# EAGLE design MysensorsSensor (EAGLE 6.6.0)
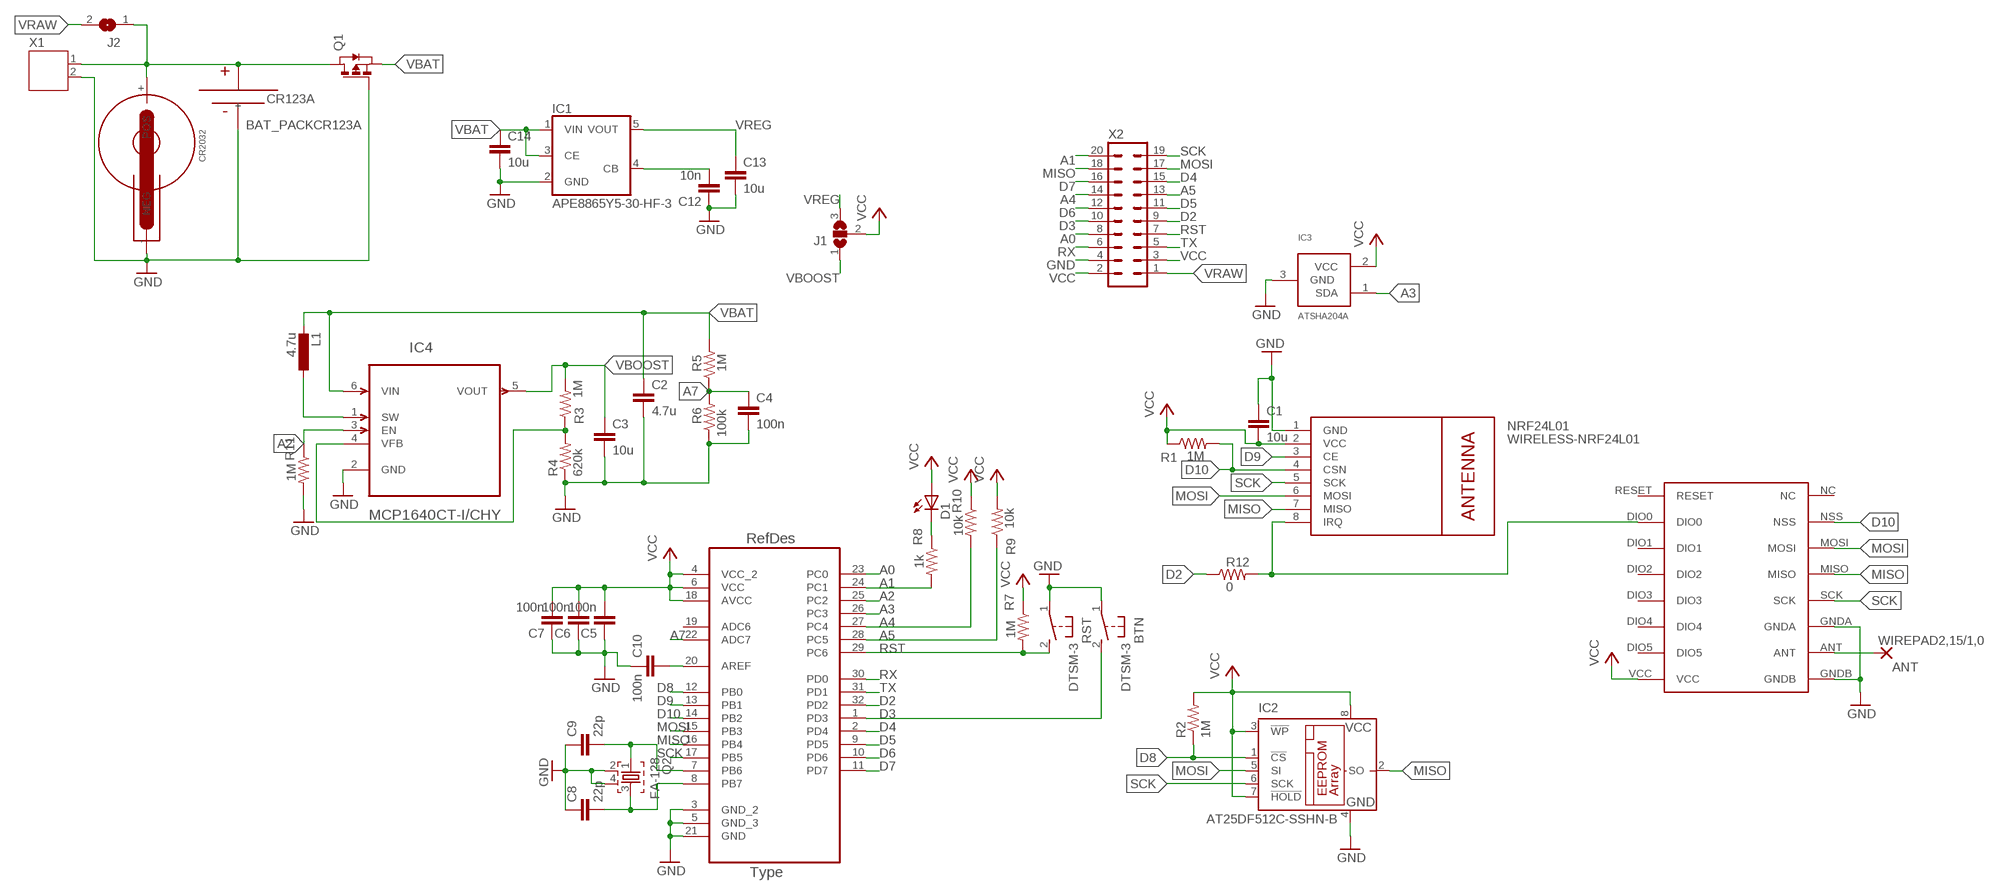
[diagram p0: schematic, sheet 1]

## Parts
ANT  WIREPAD2,15/1,0  [2,15/1,0]
BTN  DTSM-3  [DTSM-3]
C1  10u  C-EUC0603K  [C0603K]
C2  4.7u  C-EUC0603K  [C0603K]
C3  10u  C-EUC0603K  [C0603K]
C4  100n  C-EUC0402  [C0402]
C5  100n  C-EUC0402  [C0402]
C6  100n  C-EUC0402  [C0402]
C7  100n  C-EUC0402  [C0402]
C8  22p  CAP0402-CAP  [0402-CAP]
C9  22p  CAP0402-CAP  [0402-CAP]
C10  100n  C-EUC0402  [C0402]
C12  10n  C-EUC0402  [C0402]
C13  10u  C-EUC0603K  [C0603K]
C14  10u  C-EUC0603K  [C0603K]
CR123A  BAT_PACKCR123A  [BH123A]
CR2032  WA-BCPH_SMT_79527141  [79527141]
D1  LEDCHIP-LED0805  [CHIP-LED0805]
IC1  APE8865Y5-30-HF-3  TS5205  [SOT25]
IC2  AT25DF512C-SSHN-B  25AA080SN  [SO-08]
IC3  ATSHA204A  [SOT23]
IC4  MCP1640CT-I/CHY  [SOT95P270X145-6N]
IC5  ATMEGA328P-AU  [QFP80P900X900X120-32N]
J1  SJ2W  [SJ_2]
J2  SJ  [SJ]
L1  4.7u  L-EUL3225P  [L3225P]
NRF24L01  WIRELESS-NRF24L01  [WIRELESS-NRF24L01]
Q1  PMOSSOT23  [SOT-23]
Q2  FA-128  [FA-128]
R1  1M  R-US_R0603  [R0603]
R2  1M  R-US_R0603  [R0603]
R3  1M  R-US_R0603  [R0603]
R4  620k  R-US_R0603  [R0603]
R5  1M  RESISTOR0603-RES  [0603-RES]
R6  100k  RESISTOR0603-RES  [0603-RES]
R7  1M  R-US_R0603  [R0603]
R8  1k  R-US_R0603  [R0603]
R9  10k  R-US_R0603  [R0603]
R10  10k  R-US_R0603  [R0603]
R11  1M  R-US_R0603  [R0603]
R12  0  RESISTOR0603-RES  [0603-RES]
RFM69W  RFM69HW  [RFM]
RST  DTSM-3  [DTSM-3]
X1  JST-PH2  [JST-PH2]
X2  MA10-2  [MA10-2]

## Nets
A0: IC5.23(PC0) X2.8
A1: IC5.24(PC1) R8.2 X2.20
A2: IC4.3(EN) IC5.25(PC2) R11.1
A3: IC3.1(SDA) IC5.26(PC3)
A4: IC5.27(PC4) R10.2 X2.14
A5: IC5.28(PC5) R9.1 X2.13
A7: C4.1 IC5.22(ADC7) R5.1 R6.2
D2: IC5.32(PD2) R12.1 X2.9
D3: BTN.2 IC5.1(PD3) X2.10
D4: IC5.2(PD4) X2.15
D5: IC5.9(PD5) X2.11
D6: IC5.10(PD6) X2.12
D7: IC5.11(PD7) X2.16
D8: IC2.1(!CS) IC5.12(PB0) R2.1
D9: IC5.13(PB1) NRF24L01.3(CE)
D10: IC5.14(PB2) NRF24L01.4(CSN) R1.2 RFM69W.NSS
GND [Power]: BTN.1 C1.1 C2.2 C3.2 C4.2 C5.1 C6.1 C7.1 C8.1 C9.1 C10.2 C12.1 C13.2 C14.2 CR123A.- CR2032.-(NEG) IC1.2(GND) IC2.4(GND) IC3.3(GND) IC4.2(GND) IC5.3(GND_2) IC5.5(GND_3) IC5.21(GND) NRF24L01.1(GND) Q1.3(G) Q2.2 Q2.4 R4.1 R6.1 R11.2 RFM69W.GNDA RFM69W.GNDB RST.1 X1.2 X2.4
MISO: IC2.2(SO) IC5.16(PB4) NRF24L01.7(MISO) RFM69W.MISO X2.18
MOSI: IC2.5(SI) IC5.15(PB3) NRF24L01.6(MOSI) RFM69W.MOSI X2.17
N$1: IC4.4(VFB) R3.1 R4.2
N$2: C8.2 IC5.8(PB7) Q2.3
N$3: C10.1 IC5.20(AREF)
N$4: IC4.1(SW) L1.1
N$5: ANT.1(P) RFM69W.ANT
N$6: C9.2 IC5.7(PB6) Q2.1
N$7 [Power]: CR123A.+ CR2032.+(POS) J2.1 Q1.1(D) X1.1
N$8: C12.2 IC1.4(CB)
N$9: NRF24L01.8(IRQ) R12.2 RFM69W.DIO0
N$10: D1.C R8.1
RST: IC5.29(PC6) R7.2 RST.2 X2.7
RX: IC5.30(PD0) X2.6
SCK: IC2.6(SCK) IC5.17(PB5) NRF24L01.5(SCK) RFM69W.SCK X2.19
TX: IC5.31(PD1) X2.5
VBAT [Power]: C2.1 C14.1 IC1.1(VIN) IC1.3(CE) IC4.6(VIN) L1.2 Q1.2(S) R5.2
VBOOST [Power]: C3.1 IC4.5(VOUT) J1.1 R3.2
VCC [Power]: C1.2 C5.2 C6.2 C7.2 D1.A IC2.3(!WP) IC2.7(!HOLD) IC2.8(VCC) IC3.2(VCC) IC5.4(VCC_2) IC5.6(VCC) IC5.18(AVCC) J1.2 NRF24L01.2(VCC) R1.1 R2.2 R7.1 R9.2 R10.1 RFM69W.VCC X2.2 X2.3
VRAW [Power]: J2.2 X2.1
VREG [Power]: C13.1 IC1.5(VOUT) J1.3
Unconnected: IC5.19(ADC6) RFM69W.DIO1 RFM69W.DIO2 RFM69W.DIO3 RFM69W.DIO4 RFM69W.DIO5 RFM69W.NC RFM69W.RESET

## Library data of the parts
ANT = wirepad:WIREPAD: Wire PAD connect wire on PCB
BTN RST = switch-tact:DTSM-3
C1-C7 C10 C12-C14 = rcl:C-EU: CAPACITOR, European symbol
C8 C9 = SparkFun-Passives:CAP: Capacitor Standard 0603 ceramic capacitor, and 0.1" leaded capacitor.
CR123A = batteries:BAT_PACK: collection of battery footprints; DIGIKEY: BH123A-ND; MANUFACTURER: MPD; MPN: BH123A
CR2032 = Wurth_Elektronik_Electromechanic_Assembly_Spacer_rev15d:WA-BCPH: Battery Holder WA-BCPH Characteristics Flammability rating UL94-V0 Material is Phosphor Bronze Comliance:Lead free and RoHs Packaging unit is 500 <http://katalog.we-online.de/media/images/v2/Family_WA-BCPH_Battery_Holder_79527141.jpg> Details see: http://katalog.we-online.de/en/em/BCPH_BATTERY_HOLDER/79527141 2015 (C) Wurth Elektronik
D1 = led:LED: LED OSRAM: - CHIPLED LG R971, LG N971, LY N971, LG Q971, LY Q971, LO R971, LY R971 LH N974, LH R974 LS Q976, LO Q976, LY Q976 LO Q996 - Hyper CHIPLED LW Q18S LB Q993, LB Q99A, LB R99A - SideLED LS A670, LO A670, LY A670, LG A670, LP A670 LB A673, LV A673, LT A673, LW A673 LH A674 LY A675 LS A676, LA A676, LO A676, LY A676, LW A676 LS A679, LY A679, LG A679 - Hyper Micro SIDELED® LS Y876, LA Y876, LO Y876, LY Y876 LT Y87S - SmartLED LW L88C, LW L88S LB L89C, LB L89S, LG L890 LS L89K, LO L89K, LY L89K LS L896, LA L896, LO L896, LY L896 - TOPLED LS T670, LO T670, LY T670, LG T670, LP T670 LSG T670, LSP T670, LSY T670, LOP T670, LYG T670 LG T671, LOG T671, LSG T671 LB T673, LV T673, LT T673, LW T673 LH T674 LS T676, LA T676, LO T676, LY T676, LB T676, LH T676, LSB T676, LW T676 LB T67C, LV T67C, LT T67C, LS T67K, LO T67K, LY T67K, LW E67C LS E67B, LA E67B, LO E67B, LY E67B, LB E67C, LV E67C, LT E67C LW T67C LS T679, LY T679, LG T679 LS T770, LO T770, LY T770, LG T770, LP T770 LB T773, LV T773, LT T773, LW T773 LH T774 LS E675, LA E675, LY E675, LS T675 LS T776, LA T776, LO T776, LY T776, LB T776 LHGB T686 LT T68C, LB T68C - Hyper Mini TOPLED® LB M676 - Mini TOPLED Santana® LG M470 LS M47K, LO M47K, LY M47K Source: http://www.osram.convergy.de LUXEON: - LUMILED® LXK2-PW12-R00, LXK2-PW12-S00, LXK2-PW14-U00, LXK2-PW14-V00 LXK2-PM12-R00, LXK2-PM12-S00, LXK2-PM14-U00 LXK2-PE12-Q00, LXK2-PE12-R00, LXK2-PE12-S00, LXK2-PE14-T00, LXK2-PE14-U00 LXK2-PB12-K00, LXK2-PB12-L00, LXK2-PB12-M00, LXK2-PB14-N00, LXK2-PB14-P00, LXK2-PB14-Q00 LXK2-PR12-L00, LXK2-PR12-M00, LXK2-PR14-Q00, LXK2-PR14-R00 LXK2-PD12-Q00, LXK2-PD12-R00, LXK2-PD12-S00 LXK2-PH12-R00, LXK2-PH12-S00 LXK2-PL12-P00, LXK2-PL12-Q00, LXK2-PL12-R00 Source: www.luxeon.com KINGBRIGHT: KA-3528ASYC Source: www.kingbright.com
IC1 = v-reg:TS5205: 150mA Low Noise LDO Voltage Regulator with Enable TSC [Taiwan Semiconductor Company, Ltd] Source: http://www.taiwansemi.com .. 5205_0409c.pdf
IC2 = microchip:25*: Serial EEPROM 4K/ 8K , SPI bus; MF: MICROCHIP; MPN: 25AA080/SN; OC_FARNELL: 1816072; OC_NEWARK: 92C7351
IC3 = Sensor:ATSHA204A
IC4 = Microchip_By_element14_Batch_1:MCP1640CT-I/CHY: Synchronous Boost Regulator; MPN: MCP1640CT-I/CHY; OC_FARNELL: 1800208; OC_NEWARK: 73R3626; PACKAGE: SOT-6; SUPPLIER: Microchip
IC5 = Atmel-ATMEGA328P-AU:ATMEGA328P-AU; DESCRIPTION: 8-bit Microcontroller with In-System Programmable Flash; MPN: ATMEGA328P-AU; OC_FARNELL: 1715486; OC_NEWARK: 14R4631; PACKAGE: TQFP-32; SUPPLIER: Atmel
J1 = jumper:SJ2W: SMD solder JUMPER
J2 = jumper:SJ: SMD solder JUMPER
L1 = rcl:L-EU: INDUCTOR, European symbol
NRF24L01 = diy-modules:WIRELESS-NRF24L01: 2.4 GHz Wireless Module based on NRF24L01 chip More details available here: http://www.electrodragon.com/w/NRF24L01 Click here to find device on ebay.com <http://www.ebay.com/sch/nrf24l01+arduino>
Q1 = zetex:PMOSSOT23: MOS FET; OC_FARNELL: unknown; OC_NEWARK: unknown
Q2 = crystal:FA-: MHz RANGE CRYSTAL UNIT Source: Epson Toyocom
R1-R4 R7-R11 = resistor:R-US_: RESISTOR, American symbol
R5 R6 R12 = SparkFun-Passives:RESISTOR: Resistor Basic schematic elements and footprints for 0603, 1206, and PTH resistors.
RFM69W = hoperf:RFM69HW
X1 = jst-ph:JST-PH2
X2 = con-lstb:MA10-2: PIN HEADER; OC_FARNELL: unknown; OC_NEWARK: unknown

## Net classes
0 default: width 0.203 mm, drill 0.406 mm, clearance 0.203 mm
1 Power: width 0.406 mm, drill 0.406 mm, clearance 0.203 mm
2 led power: width 1.524 mm, drill 0.406 mm, clearance 0.203 mm

## Board
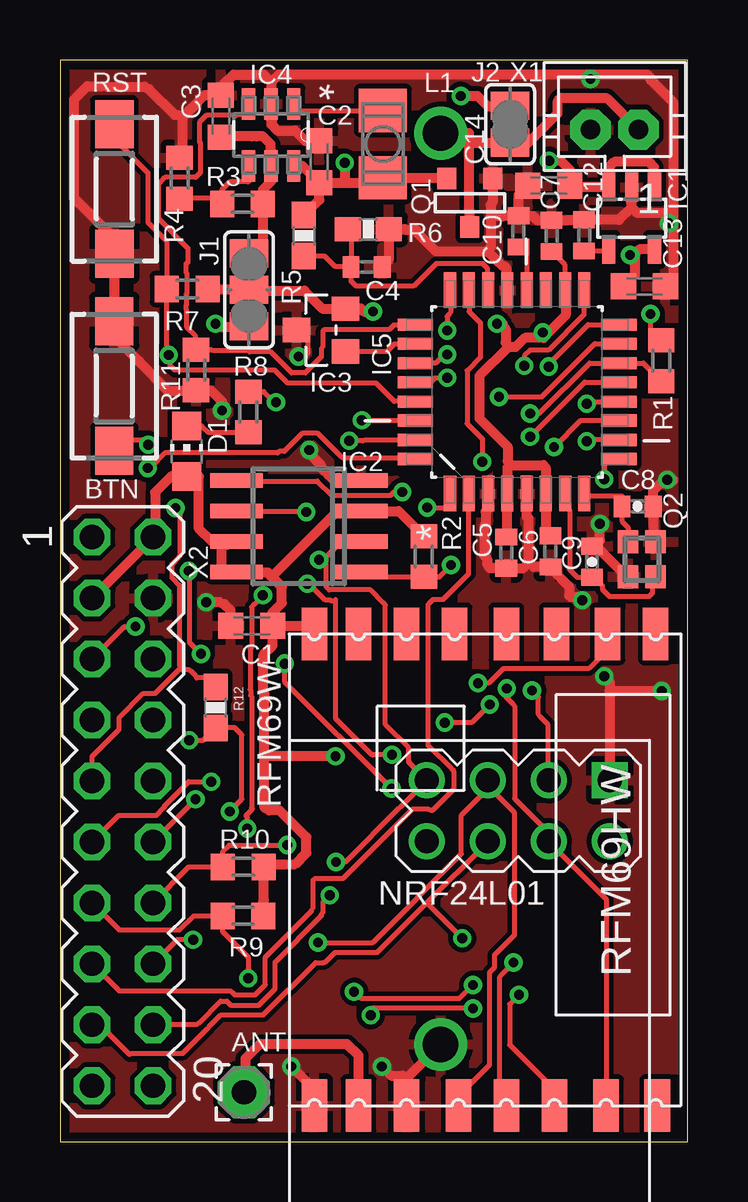
[diagram p1: board, top side]
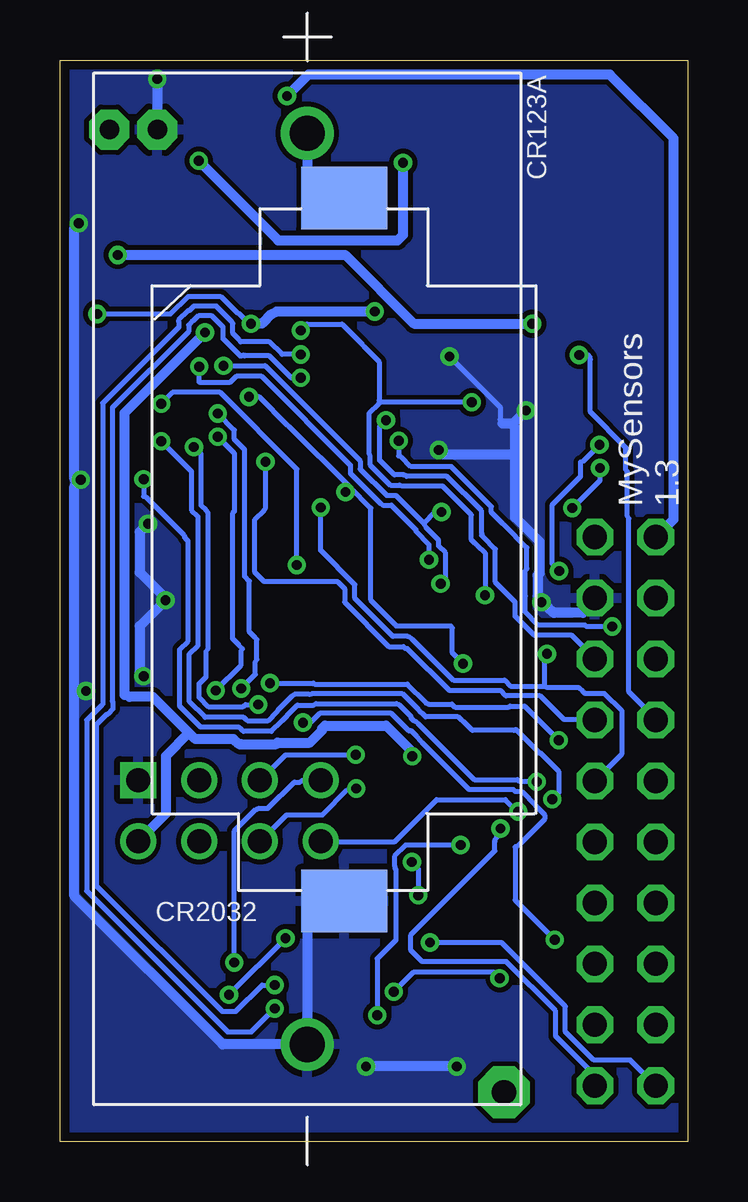
[diagram p2: board, bottom side, seen from below]

Size 26.16 x 45.07 mm. Coordinates in mm from the lower left corner, seen from the top.
Outline: 0,0 26.16,0 26.16,45.07 0,45.07 0,0
Copper layers (1*16): Top 0.0356mm / dielectric 1.5011mm / Bottom 0.0356mm
Design rules "PCBs_io": minimum track width 6mil, minimum drill 13mil, track to track 6mil, track to pad 6mil, pad to pad 6mil, via to via 6mil, smd to smd 6mil, copper to edge 15mil, drill to drill 6mil, minimum pad ring 7mil, minimum via ring 7mil, stop-mask expansion 3mil, vias tented up to drill 0mil, thermal gap 10mil

### Footprints (pad centres in the part's own frame; a part is rotated, then mirrored left to right if it is on the bottom)
2,15/1,0 = drill 1.016 pad 2.159 octagon: 1 0,0
DTSM-3 = smd 2 x 1.6: 1 -2.7,0; 2 2.7,0
C0603K = smd 1.05 x 1.08: 1 -0.875,0; 2 0.875,0
C0402 = smd 0.7 x 0.9: 1 -0.65,0; 2 0.65,0
0402-CAP = smd 0.7 x 0.9: 1 -0.65,0; 2 0.65,0
BH123A = drill 1.47: + 18.985,0; - -18.985,0
79527141 = smd 2.6 x 3.6: + 14.65,0; - -14.65,0
CHIP-LED0805 = smd 1.2 x 1.2: A 0,-1.05; C 0,1.05
SOT25 = smd 0.55 x 1.2: 1 -0.95,-1.3; 2 0,-1.3; 3 0.95,-1.3; 4 0.95,1.3; 5 -0.95,1.3
SO-08 = smd 0.6 x 2.2: 1 -1.905,-2.6; 2 -0.635,-2.6; 3 0.635,-2.6; 4 1.905,-2.6; 5 1.905,2.6; 6 0.635,2.6; 7 -0.635,2.6; 8 -1.905,2.6
SOT23 = smd 1.016 x 1.143: 1 -0.889,-1.016; 2 0.889,-1.016; 3 0,1.016
SOT95P270X145-6N = smd 1.321 x 0.559: 1 -1.295,0.94; 2 -1.295,0; 3 -1.295,-0.94; 4 1.295,-0.94; 5 1.295,0; 6 1.295,0.94
QFP80P900X900X120-32N = smd 1.473 x 0.508: 1 -4.242,2.794; 2 -4.242,2.007; 3 -4.242,1.194; 4 -4.242,0.406; 5 -4.242,-0.406; 6 -4.242,-1.194; 7 -4.242,-2.007; 8 -4.242,-2.794; 17 4.242,-2.794; 18 4.242,-2.007; 19 4.242,-1.194; 20 4.242,-0.406; 21 4.242,0.406; 22 4.242,1.194; 23 4.242,2.007; 24 4.242,2.794 | smd 0.508 x 1.473: 9 -2.794,-4.242; 10 -2.007,-4.242; 11 -1.194,-4.242; 12 -0.406,-4.242; 13 0.406,-4.242; 14 1.194,-4.242; 15 2.007,-4.242; 16 2.794,-4.242; 25 2.794,4.242; 26 2.007,4.242; 27 1.194,4.242; 28 0.406,4.242; 29 -0.406,4.242; 30 -1.194,4.242; 31 -2.007,4.242; 32 -2.794,4.242
SJ_2 = smd 1.168 x 1.6: 1 -1.524,0; 2 0,0; 3 1.524,0
SJ = smd 1.168 x 1.6: 1 -0.762,0; 2 0.762,0
L3225P = smd 1.8 x 2: 1 -1.4,0; 2 1.4,0
WIRELESS-NRF24L01 = drill 1 square: 1 -12.7,6.35 | drill 1: 2 -10.16,6.35; 3 -12.7,3.81; 4 -10.16,3.81; 5 -12.7,1.27; 6 -10.16,1.27; 7 -12.7,-1.27; 8 -10.16,-1.27
SOT-23 = smd 0.787 x 0.889: 1 0.025,-1.016; 2 -0.94,1.016; 3 0.991,1.016
FA-128 = smd 0.95 x 0.85: 1 -0.725,-0.575; 2 0.725,-0.575; 3 0.725,0.575; 4 -0.725,0.575
R0603 = smd 1 x 1.1: 1 -0.85,0; 2 0.85,0
0603-RES = smd 1.1 x 1: 1 -0.85,0; 2 0.85,0
RFM = smd 2.184 x 1.067: ANT 19.651,2.889; DIO0 0,13.27; DIO1 0,11.143; DIO2 0,9.047; DIO3 0,6.889; DIO4 0,4.889; DIO5 0,2.889; GNDA 19.651,4.889; GNDB 19.651,1.048; MISO 19.651,9.047; MOSI 19.651,11.047; NC 19.651,15.334; NSS 19.651,13.206; RESET 0,15.27; SCK 19.651,7.048; VCC 0,1.048
JST-PH2 = drill 0.813 pad 1.676 octagon: 1 1,0; 2 -1,0
MA10-2 = drill 1.016 octagon: 1 -11.43,-1.27; 2 -11.43,1.27; 3 -8.89,-1.27; 4 -8.89,1.27; 5 -6.35,-1.27; 6 -6.35,1.27; 7 -3.81,-1.27; 8 -3.81,1.27; 9 -1.27,-1.27; 10 -1.27,1.27; 11 1.27,-1.27; 12 1.27,1.27; 13 3.81,-1.27; 14 3.81,1.27; 15 6.35,-1.27; 16 6.35,1.27; 17 8.89,-1.27; 18 8.89,1.27; 19 11.43,-1.27; 20 11.43,1.27

### Placement (x,y rotation side)
ANT  7.66,2.06 0 top
BTN  2.26,31.48 270 top
C1  7.99,21.49 0 top
C2  10.81,40.82 90 top
C3  6.71,42.73 90 top
C4  12.77,36.44 0 top
C5  18.59,24.54 90 top
C6  20.43,24.59 90 top
C7  20.49,37.74 270 top
C8  24.07,26.47 180 top
C9  22.17,24.16 270 top
C10  19.1,37.92 90 top
C12  21.84,37.76 270 top
C13  24.35,35.64 0 top
C14  20.37,39.84 180 top
CR123A  15.86,23.03 90 bottom
CR2032  14.32,24.67 90 bottom
D1  5.28,28.77 0 top
IC1  23.82,38.48 180 top
IC2  9.95,25.64 90 top
IC3  10.87,33.82 90 top
IC4  8.8,41.94 270 top
IC5  19.04,31.24 90 top
J1  7.87,35.49 270 top
J2  18.76,42.39 90 top
L1  13.46,41.57 270 top
NRF24L01  16.56,2.36 270 top
Q1  17.05,39.12 0 top
Q2  24.24,24.27 90 top
R1  25.05,32.54 270 top
R2  15.16,24.38 90 top
R3  7.61,39.07 0 top
R4  4.98,40.15 270 top
R5  10.16,37.75 90 top
R6  12.85,38.02 180 top
R7  5.3,35.53 180 top
R8  7.85,30.4 90 top
R9  7.62,9.41 0 top
R10  7.63,11.45 180 top
R11  5.67,32.15 270 top
R12  6.48,18.09 270 top
RFM69W  9.55,21.16 270 top
RST  2.26,39.69 90 top
X1  23.11,42.17 0 top
X2  2.61,13.76 270 top

### Tracks (layer width: path | path; a pad name or v marks a point on that pad's centre or on a via)
A0  (via drill 0.41)
  Top 0.203: 17.03,35.48 IC5.23 17.03,35.38 17.03,34.85 17.05,34.83 17.05,34.59 17.52,34.12 17.52,32.68 16.97,32.13 16.97,29.91 17.6,29.29 v17.6,28.33
  Bottom 0.203: X2.8 | 3.98,17.58 X2.8 | v17.6,28.33 17.6,26.4 17.66,26.32 18.04,25.93 18.04,23.72 17.66,23.33 14.59,23.33 14.3,23.05 14.3,22.48 12.46,20.63 11.85,20.63 11.79,20.55 11.68,20.55 9.94,18.8 7.8,18.8 7.58,18.58 6.16,18.58 5.16,17.58 4.08,17.58 X2.8
A1  (via drill 0.41)
  Top 0.203: 16.25,35.05 IC5.24 16.26,34.95 16.26,34.85 16.28,34.83 16.28,34.55 16.21,34.47 16.13,34.39 v16.13,33.8 | v8.45,22.76 8.07,22.38 8.01,22.3 7.99,22.27 7.99,20.61 7.92,20.55 7.92,18.84 7.95,18.82 7.95,18.6 7.99,18.56 7.99,13.92 8.01,13.84 7.74,13.58 7.8,13.5 v7.8,13.05 | v9,30.81 8.94,30.81 8.49,31.26 7.86,31.26 R8.2
  Bottom 0.203: X2.20 3.88,2.77 5.51,4.39 5.51,5.45 7.56,7.5 11.07,7.5 11.54,7.97 11.54,8.62 8.05,12.12 8.05,12.5 8.03,12.6 7.96,12.68 7.8,12.85 v7.8,13.05 | v8.45,22.76 8.45,24.53 8.78,24.86 8.86,24.92 9.02,25.08 9.02,26.12 10.22,27.31 11.91,27.31 12.01,27.36 12.39,27.36 13.25,28.21 13.25,28.55 13.27,28.64 13.27,30.36 12.88,30.75 12.8,30.81 | v9,30.81 12.8,30.81 | v16.13,33.8 15.87,34.06 14.41,34.06 13.57,33.23 13.51,33.15 12.86,32.5 12.86,30.89 12.8,30.81
A2
  Top 0.203: IC4.3 7.86,43.23 7.86,42.78 7.38,42.78 7.36,42.76 6.1,42.76 5.81,42.47 5.81,41.9 5.81,41.82 5.81,41.66 5.85,41.62 5.85,40.38 5.77,40.3 5.65,40.18 4.37,40.18 4.31,40.12 4.08,39.89 4.08,39.36 4.08,39.26 4.08,38.47 5.32,37.23 5.32,36.64 5.24,36.58 5.24,36.22 5.28,36.17 5.28,35.34 5.26,35.26 5.26,34.85 5.24,34.83 5.24,34.69 5.26,34.67 5.26,33.96 5.63,33.59 5.63,33.04 R11.1 6.28,33 6.38,32.96 7.82,32.96 7.9,32.9 8.78,32.9 9.65,32.03 10.22,32.03 10.89,32.7 10.89,33.05 10.95,33.13 10.95,33.78 11.01,33.84 13.72,33.84 13.9,34.02 14.14,34.02 14.16,34.04 IC5.25
A3
  Top 0.203: IC3.1 11.91,32.92 13.61,32.92 13.92,33.23 14.14,33.23 14.16,33.25 IC5.26
A4  (via drill 0.41)
  Top 0.203: X2.14 3.88,9.96 5.36,11.44 6.77,11.44 R10.2 6.79,11.55 6.79,12.1 7.05,12.36 v9.47,12.36 | v16.13,32.8 16.03,32.8 15.69,32.45 15.46,32.45 15.44,32.44 14.81,32.44 IC5.27 | v17.21,5.55 12.94,5.55 v12.94,5.27
  Bottom 0.203: v16.13,32.8 16.91,32.8 17.43,33.33 18.63,33.33 18.69,33.41 18.96,33.67 18.96,34.08 19,34.16 19.65,34.81 20.58,34.81 20.77,34.63 20.83,34.63 21.23,34.22 21.23,34.18 21.21,34.16 21.21,33.94 24.38,30.77 24.38,18.21 24.46,18.15 25.05,17.56 25.05,10.45 19.18,4.58 18.19,4.58 v17.21,5.55 | v12.94,5.27 12.94,7.62 12.17,8.4 12.17,11.34 12.21,11.38 12.21,11.46 12.23,11.48 12.23,11.89 11.77,12.36 v9.47,12.36
A5  (via drill 0.41)
  Top 0.203: X2.13 2.46,8.82 4.98,8.82 5.57,9.41 R9.1 6.77,9.31 6.77,8.76 7.84,7.68 v7.84,6.81 | v16.13,31.82 15.63,31.82 15.44,31.64 14.81,31.64 IC5.28 | v17.21,6.53 16.64,5.96 12.56,5.96 12.46,6.06 12.38,6.12 v12.25,6.24
  Bottom 0.203: v16.13,31.82 16.52,31.82 17.43,32.74 18.47,32.74 18.51,32.78 18.59,32.74 18.65,32.74 19.36,33.45 19.36,33.94 19.83,34.41 20.4,34.41 20.58,34.22 20.62,34.22 20.69,34.14 20.81,34.02 20.81,33.76 23.98,30.59 23.98,18.39 23.96,18.31 23.96,18.03 24.18,17.8 24.22,17.8 24.65,17.38 24.65,10.67 19.41,5.43 18.84,5.43 17.74,6.53 v17.21,6.53 | v7.84,6.81 8.11,7.08 11.42,7.08 v12.25,6.24
A7
  Top 0.203: R5.1 11.02,36.9 11.44,36.48 12.09,36.48 C4.1 | C4.1 12.13,36.56 12.13,38.02 R6.2 | C4.1 12.13,36.36 12.13,35.85 12.33,35.65 14.73,35.65 15.67,36.58 17.62,36.58 17.82,36.38 17.82,36.15 17.84,36.13 17.84,35.5 IC5.22
D2  (via drill 0.41)
  Top 0.203: 5,19.71 3.96,18.68 3.48,18.68 2.46,17.66 2.46,17.18 1.34,16.06 1.34,15.04 X2.9 | 5,26.28 4.88,26.4 v4.82,26.4 5,26.2 5,24.41 4.86,24.27 4.8,24.18 4.67,24.06 4.67,23.49 5,23.17 5,19.82 5,19.71 | IC5.32 14.16,28.45 14.14,28.47 11.81,28.47 11.72,28.53 10.75,29.51 10.1,29.51 9.35,28.76 9.14,28.76 9.06,28.7 4.37,28.7 3.8,28.13 3.74,28.13 v3.66,28.07 | 5,19.71 5.08,19.65 5.38,19.65 5.47,19.59 5.65,19.41 5.69,19.33 6.48,19.33 R12.1
  Bottom 0.203: v3.66,28.07 3.66,27.56 v4.82,26.4
D3  (via drill 0.41)
  Top 0.203: v15.3,26.42 16.24,26.42 16.26,26.44 IC5.1 | 5.36,23.8 v5.36,23.78 5.41,23.7 5.41,20.79 v5.87,20.32 | v3.68,29.04 3.5,29.22 2.26,29.22 2.26,28.8 BTN.2
  Bottom 0.203: X2.10 3.86,15.04 2.82,16.08 2.76,16.14 2.76,17.97 3.48,18.68 4.29,18.68 4.37,18.74 4.55,18.92 5.87,18.92 5.95,18.98 | v15.3,26.42 15.3,24.63 13.88,23.21 13.88,22.64 12.36,21.12 12.29,21.06 11.68,21.06 11.58,21.02 11.5,20.95 9.77,19.23 7.64,19.23 7.4,18.98 5.95,18.98 | 5.95,18.98 5.95,20.26 v5.87,20.32 | v5.36,23.78 5.38,23.8 5.65,24.06 5.65,26.54 4.47,27.72 4.47,28.31 4.37,28.35 v3.68,29.04
D4
  Top 0.203: X2.15 2.46,6.28 7.09,6.28 7.17,6.22 7.28,6.12 8.13,6.12 8.55,6.55 8.55,7.68 10.48,9.62 10.48,9.66 10.55,9.74 10.55,10.9 10.63,10.96 11.79,10.96 14.67,13.84 15.36,13.84 15.46,13.8 15.52,13.8 16.4,14.68 16.4,15.45 16.34,15.51 15.34,16.5 15.34,22.38 15.4,22.46 15.54,22.6 15.97,22.6 17.03,23.66 17.03,26.99 IC5.2
D5  (via drill 0.41)
  Top 0.203: v6.3,15 5.36,15 4.35,13.98 4.35,13.92 4.02,13.6 2.44,13.6 X2.11 | v22.68,27.6 22.68,28.43 22.7,28.45 23.27,28.45 IC5.9
  Bottom 0.203: v22.68,27.6 22.68,26.89 22.58,26.85 20.99,25.26 20.97,25.18 20.91,25.1 20.83,25.02 20.83,20.85 21.17,20.51 21.17,18.15 20.3,17.28 18.71,17.28 18.59,17.15 18.51,17.09 17.35,17.09 16.95,17.5 16.87,17.56 16.87,17.58 16.7,17.74 16.7,17.76 16.28,18.19 15.59,18.19 15.5,18.25 12.13,18.25 12.11,18.23 12.03,18.21 11.54,17.72 11.54,17.66 11.42,17.54 11.34,17.5 11.26,17.44 8.9,15.08 7.09,15.08 7.03,15.02 6.32,15.02 v6.3,15
D6  (via drill 0.41)
  Top 0.203: IC5.10 23.27,29.25 22.03,29.25 v21.95,29.18 | v5.65,14.27 X2.12
  Bottom 0.203: v21.95,29.18 20.69,27.92 20.69,26.32 20.42,26.05 20.42,20.67 20.77,20.32 20.77,18.33 20.12,17.68 18.51,17.68 18.41,17.58 18.33,17.52 17.52,17.52 17.13,17.91 17.07,17.99 16.48,18.58 16.4,18.64 15.77,18.64 15.69,18.66 11.89,18.66 11.22,17.99 11.16,17.91 11.07,17.84 10.93,17.7 9.57,17.7 9.43,17.56 9.35,17.5 8.98,17.13 7.25,17.13 7.17,17.18 6.2,16.2 6.16,16.2 5.36,15.41 5.36,14.55 v5.65,14.27
D7  (via drill 0.41)
  Top 0.203: v5.55,8.42 4.88,8.42 3.88,7.42 X2.16 | v20.58,28.94 21.7,30.06 23.27,30.06 IC5.11 | v16.03,17.46 17.15,17.46 17.88,18.19 v17.9,18.21
  Bottom 0.203: v20.58,28.94 20.36,28.72 20.28,28.66 20.28,26.5 20.08,26.3 20.02,26.22 20.02,20.51 20.08,20.43 20.08,19.37 20.36,19.09 20.36,18.52 19.95,18.11 18.55,18.11 18.51,18.15 18.43,18.21 v17.9,18.21 | v5.55,8.42 7.19,10.06 7.19,12.28 7.09,12.32 5.97,13.44 5.97,13.62 6.28,13.92 6.34,14.01 6.93,14.59 7.21,14.59 7.28,14.68 9.12,14.68 11.1,16.65 11.16,16.73 11.18,16.73 11.24,16.81 11.28,16.87 11.52,17.11 11.62,17.11 12.36,17.84 15.34,17.84 15.73,17.46 v16.03,17.46
D8  (via drill 0.41)
  Top 0.203: IC2.1 13.19,23.74 13.39,23.54 R2.1 15.26,23.54 15.81,23.54 v16.3,24.02 | v21.95,30.75 22.03,30.83 23.27,30.83 IC5.12
  Bottom 0.203: v21.95,30.75 21.48,31.22 19.49,31.22 16.3,28.03 v16.3,24.02
D9  (via drill 0.41)
  Top 0.203: v19.59,29.37 21.86,31.64 23.27,31.64 IC5.13 | 20.38,15.06 NRF24L01.3 20.32,15.14 20.32,17.4 20,17.72 19.93,17.8 19.93,18.54 v19.67,18.8
  Bottom 0.203: v19.59,29.37 18.9,28.68 18.9,26.26 18.98,26.18 18.98,20.98 18.71,20.71 18.65,20.63 18.55,20.53 18.61,20.45 18.61,19.86 v19.67,18.8
D10  (via drill 0.41)
  Top 0.203: v19.59,30.34 19.98,30.34 22.07,32.44 23.27,32.44 IC5.14 24.31,32.44 R1.2 | RFM69W.NSS 22.76,10.1 20.42,12.44 NRF24L01.4 20.32,12.6 20.32,12.91 18.94,14.29 18.94,18.15 18.88,18.23 18.61,18.5 v18.61,18.88
  Bottom 0.203: v19.59,30.34 18.9,29.65 18.9,29.27 18.47,28.84 18.47,23.55 18.27,23.35 18.27,21.24 18.02,21 17.96,20.91 17.96,20.08 18.02,20 18.02,19.47 v18.61,18.88
GND  (via drill 0.41)
  Top 0.203: IC3.3 9.96,33.82 10.32,33.82 10.32,32.82 10.24,32.76 10.2,32.72 v9.94,32.72
  Top 0.406: 19.52,24.12 19.52,25.98 19.45,26.05 IC5.5 | 19.52,24.12 19.29,23.9 18.61,23.9 C5.1 18.38,23.9 17.9,23.9 17.86,23.97 17.8,24.08 17.8,24.29 17.68,24.41 17.68,25.67 17.74,25.73 17.74,26.26 17.84,26.36 IC5.3 | 19.52,24.12 19.68,24 19.73,23.95 20.41,23.95 C6.1 20.62,23.94 20.71,23.94 20.71,23.64 21.21,23.13 21.21,22.76 21.27,22.7 21.66,22.7 21.76,22.6 v21.76,22.56 | 18.63,35.5 IC5.21 18.63,35.71 18.63,36.13 18.61,36.15 18.61,36.38 18.53,36.46 18.47,36.46 17.84,37.09 | 5.1,42.7 5.34,42.93 5.49,43.06 6.04,43.61 6.68,43.61 C3.2 6.79,43.79 6.79,44.02 7.23,44.46 8.47,44.46 8.8,44.14 | 5.1,41.09 R4.1 5.1,41.3 5.1,42.7 | 5.1,42.7 4.9,42.78 4.78,42.78 3.7,43.85 3.52,43.96 1.95,43.96 1.77,43.98 1.14,43.98 0.59,43.43 0.59,39.3 2.26,37.64 2.26,37.19 RST.1 BTN.1 2.26,33.98 2.26,33.53 3.27,32.52 | C2.2 10.61,41.7 10.22,41.7 9.79,42.13 9.08,42.13 8.82,42.39 8.82,42.58 8.8,42.59 8.8,43.04 IC4.2 8.8,43.43 8.8,44.14 | 3.27,32.52 4.49,31.3 5.47,31.3 R11.2 5.87,31.3 6.3,31.3 6.75,30.85 v6.75,30.46 6.77,30.46 6.85,30.55 6.85,30.65 | C4.2 13.7,36.72 R6.1 14.35,38.02 14.37,38 14.83,38 14.94,37.82 15.67,37.09 17.84,37.09 | Q1.3 18.04,40.12 18.04,39.2 17.94,39.02 17.94,38.55 | 14.45,2.65 RFM69W.GNDA | 14.45,2.65 CR123A.- | 3.29,32.54 3.27,32.52 | v13.41,3.13 13.8,2.75 14.27,2.75 14.45,2.65 | v9.63,3.13 10.61,2.16 RFM69W.GNDB | C1.1 7.11,21.5 7.11,22.13 6.85,22.4 6.64,22.48 v6.1,22.48 | Q2.4 23.61,23.54 22.34,24.81 C9.1 22.43,25 22.49,25.06 v22.49,25.75 | Q2.2 24.72,25.09 C8.1 24.71,26.66 24.71,27.11 25.09,27.5 v25.3,27.58 25.56,27.58 | IC2.4 12.54,27.54 11.91,27.54 11.81,27.44 11.54,27.44 10.95,28.03 10.85,28.21 10.38,28.68 v10.38,28.82
  Top 0.406: 22.9,18.78 22.9,19.17 v22.68,19.39 | 22.9,18.78 NRF24L01.1 | 8.8,44.14 9.12,44.46 22.11,44.46 | 22.11,44.46 24.46,44.46 24.53,44.4 24.63,44.22 25.56,43.29 25.56,38.71 | 22.9,18.78 v25.07,18.78 | v22.11,44.28 22.11,44.46 | 25.56,38.27 25.56,35.6 25.53,35.63 C13.2 | 25.56,38.27 25.56,38.71 | 17.94,38.55 17.94,37.27 17.84,37.09 | 17.94,38.55 18.43,38.55 18.45,38.57 18.9,38.57 C10.2 | C10.2 19.28,38.57 19.71,38.57 19.89,38.39 C7.1 20.69,38.39 21.13,38.39 21.15,38.41 21.82,38.41 C12.1 22.05,38.41 23.29,38.41 23.8,38.92 | C14.2 19.1,39.44 C10.2 | 23.8,38.92 23.8,39.12 23.82,39.14 IC1.2 | 25.56,38.71 24.04,38.71 23.96,38.8 23.8,38.92 | v25.38,38.27 25.56,38.27
  Bottom 0.203: v9.94,32.72 7.82,30.61 7.82,30.1 7.72,29.91
  Bottom 0.406: 3.88,22.66 X2.4 3.94,22.46 4.37,22.03 5.59,22.03 5.83,22.27 v6.1,22.48 | CR2032.- 15.86,10.02 CR123A.- 19.39,4.05 25.56,10.22 25.56,18.78 | 7.29,29.91 7.72,29.91 | v6.75,30.46 7.29,29.91 | v9.63,3.13 v13.41,3.13 | 7.19,28.64 7.19,26.01 6.18,25 6.18,23.68 6.26,23.6 6.26,22.72 6.2,22.66 v6.1,22.48 | 7.19,28.64 7.19,29.73 7.29,29.91 | 25.56,18.78 25.56,27.31 v25.3,27.58 25.56,27.6 25.56,38.08 v25.38,38.27 | 7.19,28.64 10.2,28.64 v10.38,28.82 | v22.68,19.39 22.84,19.55 22.84,21.48 v21.76,22.56 21.86,22.74 22.84,23.72 22.84,25.4 v22.49,25.75 | v25.07,18.78 25.56,18.78 | v6.1,22.48 5.99,22.4 | v22.11,44.28 X1.2
  pour Bottom: 0,0 26.16,0 26.16,45.07 0,45.07
  pour Top: 0,0 26.16,0 26.16,45.07 0,45.07
MISO  (via drill 0.41, 0.41 pad 0.41)
  Top 0.203: X2.18 3.88,4.88 5.69,4.88 5.77,4.94 6.68,5.86 6.95,5.86 7.11,5.69 8.29,5.69 8.96,6.36 8.96,7.48 10.89,9.41 10.89,9.47 10.95,9.55 10.95,9.98 v11.24,10.27 | 23.94,34.02 23.92,34.04 IC5.16 23.18,34.04 22.01,34.04 20.36,32.39 v20.36,32.29 | v11.5,11.65 11.89,11.65 14.12,13.88 14.18,13.94 15.22,14.98 NRF24L01.7 14.53,15.81 14.53,15.89 14.53,16.4 13.55,17.38 13.55,22.36 13.49,22.44 12.94,22.99 11.22,22.99 11.1,23.11 11.1,24.25 | RFM69W.MISO 18.59,2.14 18.33,2.4 18.33,6.87 18.39,6.95 v18.9,7.46 | 11.1,24.25 11.1,24.37 11.72,25 12.54,25 IC2.2 | v10.79,24.25 11.1,24.25
  Bottom 0.203: v11.24,10.27 11.24,11.38 v11.5,11.65 | v18.9,7.46 18.9,12.95 18,13.84 17.96,13.84 17.86,13.88 17.5,13.88 16.4,14.98 16.15,14.98 16.07,15.04 15.3,15.04 NRF24L01.7 | v10.79,24.25 10.79,24.88 11.34,25.43 11.34,25.51 12.36,26.52 12.72,26.52 12.8,26.58 14.06,27.84 14.06,28.19 17.78,31.91 18.8,31.91 19.06,31.64 20.36,31.64 v20.36,32.29
MOSI  (via drill 0.41)
  Top 0.203: 17.82,12.5 NRF24L01.6 | X2.17 1.67,4.86 2.91,3.62 2.99,3.68 5.12,3.68 6.16,4.72 | v18.29,31.03 20.08,31.03 22.29,33.25 23.27,33.25 IC5.15 | 20.6,2.14 RFM69W.MOSI 20.54,2.22 18.73,4.03 18.73,5.74 v19.12,6.12 | 17.92,12.48 NRF24L01.6 | 6.16,4.72 6.16,4.74 | 15.29,9.95 13.23,7.89 11.46,7.89 11.07,7.5 10.97,7.46 10.65,7.46 8.47,5.29 6.71,5.29 6.22,4.8 6.16,4.72 | 15.29,9.95 17.76,12.42 NRF24L01.6 | v16.76,8.48 15.36,9.88 15.29,9.95 | v9.37,19.92 9.37,19.15 13.8,14.72 v13.82,14.72 | v14.27,27.07 13.92,27.07 13.78,26.93 11.32,26.93 10.73,27.52 8.01,27.52 7.99,27.54 7.36,27.54 IC2.5
  Bottom 0.203: NRF24L01.6 16.72,13.62 15.22,13.62 14.18,14.65 13.9,14.65 v13.82,14.72 | 14.07,27.26 13.21,26.4 13.21,22.56 12.19,21.54 12.13,21.48 9.88,21.48 9.81,21.4 9.81,20.36 v9.37,19.92 | 14.07,27.26 16.58,29.77 16.66,29.83 17.86,31.03 v18.29,31.03 | v16.76,8.48 v19.12,6.12 | v14.27,27.07 14.14,27.19 14.07,27.26
N$1
  Top 0.203: 5.31,39.07 R4.2 5.16,39.28 5.16,39.3 6.67,39.3 R3.1 6.75,39.36 6.75,39.67 7.07,39.99 7.84,39.99 7.86,40.01 IC4.4
N$2
  Top 0.203: IC5.8 21.84,26.91 23.41,26.91 23.41,26.48 C8.2 23.41,26.38 23.41,25.85 23.67,25.59 Q2.3
N$3
  Top 0.203: IC5.20 19.45,35.5 19.45,37.05 C10.1
N$4
  Top 0.203: 13.26,42.77 L1.1 13.29,42.94 13.29,42.96 9.73,42.96 9.73,43.23 IC4.1
N$5
  Top 0.406: RFM69W.ANT 12.44,3.6 11.97,4.07 8.33,4.07 7.72,3.46 7.72,2.12 ANT.1
N$6
  Top 0.203: 21.05,26.5 IC5.7 | 21.05,26.5 21.05,26.36 | 21.05,26.5 21.23,26.32 21.23,23.84 21.56,23.52 22.15,23.52 C9.2 22.25,23.51 22.6,23.17 22.6,23.01 22.88,22.72 24.55,22.72 24.69,22.86 24.69,23.41 Q2.1
N$7
  Top 0.406: X1.1 22.8,43.47 20.83,43.47 20.73,43.29 20.73,42.84 19.51,41.62 18.96,41.62 J2.1 18.73,41.62 18.11,41.62 18.09,41.6 17.05,41.6 | CR123A.+ 17.05,42.03 17.05,41.6 | 17.05,41.6 17.05,38.76 17.07,38.73 Q1.1
  Bottom 0.406: CR2032.+ 14.91,39.32 15.85,40.26 15.85,42.01 CR123A.+
N$8
  Top 0.203: C12.2 22.86,37.11 IC1.4
N$9  (via drill 0.41)
  Top 0.203: v17.41,19.11 17.86,19.11 18.47,19.71 22.03,19.71 22.82,20.51 RFM69W.DIO0 | R12.2 6.48,17.68 6.5,17.68 | v7.07,13.76 7.58,14.27 7.58,16.95 7.28,17.26 6.5,17.26 R12.2 | v5.38,16.73 5.97,16.73 R12.2
  Bottom 0.203: v17.41,19.11 15.61,19.11 15.56,19.06 11.68,19.06 10.93,18.31 10.93,18.29 10.91,18.27 10.81,18.23 9.84,18.23 9.71,18.11 7.46,18.11 7.42,18.15 6.81,18.15 v5.38,16.73 | NRF24L01.8 15.28,12.5 12.21,12.5 10.46,14.25 7.6,14.25 7.09,13.74 v7.07,13.76
N$10
  Top 0.203: R8.1 6.18,29.55 5.91,29.81 D1.C
RST  (via drill 0.41)
  Top 0.203: 2.28,41.72 2.26,41.74 2.26,42.37 RST.2 2.36,41.68 3.66,40.38 3.66,38.31 4.45,37.52 4.45,35.54 R7.2 4.45,35.44 4.45,32.78 v4.53,32.78 4.59,32.7 4.59,32.33 4.78,32.15 8.94,32.15 9.49,31.6 13.17,31.6 13.92,30.85 14.14,30.85 14.16,30.83 IC5.29
  Bottom 0.203: X2.7 1.38,17.66 2.46,18.74 2.46,25.97 2.52,26.05 2.52,27.9 2.58,27.98 2.58,28.92 4.06,30.4 4.06,32.6 4.08,32.7 4.14,32.78 v4.53,32.78
RX  (via drill 0.41)
  Top 0.203: v12.58,30.06 IC5.30
  Bottom 0.203: v12.58,30.06 12.84,29.79 12.84,28.39 12.23,27.78 11.85,27.78 11.74,27.74 11.72,27.72 10.04,27.72 8.6,26.28 8.6,25.36 8.6,25.26 8.51,25.2 8.51,25.18 8.03,24.69 8.03,23.31 7.19,22.48 7.19,21.89 6.4,21.1 4.84,21.1 3.94,20.2 X2.6
SCK  (via drill 0.41, 0.41 pad 0.41)
  Top 0.203: v13.84,16.12 13.03,16.12 12.94,16.16 11.48,17.62 11.48,22.54 | v19.34,32.33 19.34,32.74 19.59,32.98 20.36,32.98 21.82,34.45 21.82,34.83 21.84,34.85 IC5.17 | v10.75,8.29 13.03,8.29 16.72,11.99 16.72,13.6 17.82,14.7 17.82,15.04 NRF24L01.5 17.9,14.63 18,14.63 18.94,13.7 18.94,8.62 18.11,7.79 18.11,7.26 17.9,7.05 17.9,3.19 16.87,2.16 16.62,2.16 16.6,2.14 RFM69W.SCK | IC2.6 10.22,26.28 v10.26,26.24 | 11.48,22.54 11.48,22.58 | v10.3,23.25 10.36,23.25 11.05,22.56 11.26,22.56 11.28,22.54 11.48,22.54
  Bottom 0.203: v13.84,16.12 16.76,16.12 NRF24L01.5 | X2.19 2.4,3.4 3.92,3.4 5.1,4.58 5.1,5.63 7.76,8.29 v10.75,8.29 | 11.01,25.77 12.17,26.93 12.56,26.93 13.65,28.03 13.65,28.37 17.62,32.33 v19.34,32.33 | v10.26,26.24 10.55,26.24 11.01,25.77 | 11.01,25.77 10.97,25.69 10.91,25.61 10.91,25.59 10.38,25.06 10.38,24.82 10.1,24.53 10.1,23.45 v10.3,23.25
TX  (via drill 0.41)
  Top 0.203: v3.15,21.46 2.68,21.46 X2.5 | IC5.31 12.72,29.25 12.62,29.2 v12.05,29.2
  Bottom 0.203: v3.15,21.46 4.21,21.46 4.29,21.52 6.24,21.52 6.79,22.07 6.79,22.72 6.77,22.74 6.77,23.8 6.71,23.88 6.71,24.75 7.64,25.69 7.72,25.75 8.19,26.22 8.19,26.46 9.86,28.13 11.54,28.13 11.95,28.53 12.05,28.57 v12.05,29.2
VBAT  (via drill 0.41)
  Top 0.406: C2.1 10.81,39.24 R5.2 | IC4.6 10.11,40.65 C2.1 | Q1.2 14.05,40.14 14.02,40.17 L1.2 13.24,39.95 11.87,39.95 | IC1.1 24.77,40.42 24.75,40.44 24.75,40.6 24.53,40.83 23.1,40.83 22.86,40.58 IC1.3 21.31,39.77 C14.1 21.25,40.03 21.25,40.48 20.87,40.87 v20.38,40.87 | C2.1 11.87,39.95 | v11.87,40.79 11.87,39.95
  Bottom 0.406: v11.87,40.79 11.87,37.78 12.09,37.56 17.07,37.56 v20.38,40.87
VBOOST
  Top 0.406: J1.1 8.05,37.19 8.43,37.19 8.46,37.21 R3.2 8.45,39.26 8.45,39.67 8.8,40.01 IC4.5 8.8,40.85 8.8,41.3 8.78,41.31 8.78,41.56 8.45,41.88 8.19,41.88 | 8.01,41.88 | 8.01,41.88 6.74,41.88 C3.1 | 8.19,41.88 | 8.19,41.88 8.01,41.88
VCC  (via drill 0.41)
  Top 0.203: 21.05,35.68 21.05,36.53 C7.2 | v24.61,34.49 24.61,33.39 25.03,33.39 R1.1
  Top 0.406: X2.3 X2.2 3.96,25.38 3.96,27.05 4.63,27.72 5.26,27.72 D1.A 5.47,27.72 5.79,27.72 5.79,25.55 6.32,25.02 6.68,25.02 6.71,25 7.34,25 IC2.7 | C5.2 18.61,25.17 18.63,25.19 18.63,26.82 IC5.4 18.63,27.19 18.63,27.64 18.65,27.66 18.65,28.09 18.75,28.19 | 21.05,35.68 IC5.18 21.05,35.3 21.05,34.85 21.07,34.83 21.07,34.43 20.24,33.59 | R7.1 6.18,35.49 J1.2 8.07,35.48 8.51,35.48 8.53,35.46 10.18,35.46 10.93,34.71 IC3.2 12.09,34.71 12.54,34.71 12.66,34.59 v13.04,34.59 | R10.1 8.49,11.44 8.49,10.06 8.47,10.04 R9.2 | R2.2 14.11,26.28 IC2.3 12.36,26.28 11.91,26.28 11.89,26.26 11.5,26.26 11.38,26.09 8.83,23.55 | IC2.7 6.73,24.82 6.73,23.76 6.75,23.74 7.34,23.74 IC2.8 7.54,23.74 7.99,23.74 8.01,23.72 8.66,23.72 8.83,23.55 | 10.61,21.77 10.61,21.2 10.67,21.14 10.67,20.83 10.63,20.79 10.61,20.79 RFM69W.VCC | 8.51,16.06 8.51,13.92 8.53,13.9 8.72,13.8 9.14,13.8 10.26,12.68 10.26,12.03 9.79,11.57 8.68,11.57 R10.1 | 8.51,16.06 8.51,18.62 8.47,18.8 8.47,20.28 8.86,20.67 8.86,21.3 C1.2 | 10.51,20.61 RFM69W.VCC | 8.49,11.65 R10.1 | 7.56,25 IC2.7 | C1.2 10.27,21.49 RFM69W.VCC | C6.2 20.24,25.44 IC5.6 20.24,27.19 20.24,28.09 20.14,28.19 18.75,28.19 | 8.83,23.55 8.96,23.39 9.25,23.11 9.25,22.44 8.86,22.05 8.86,21.69 C1.2 | v11.48,16.06 8.51,16.06 | 18.67,33.11 18.65,33.09 17.48,31.91 17.48,30.14 18.65,28.96 18.65,28.37 18.75,28.19 | 18.67,33.11 18.98,33.11 19.36,33.49 20.14,33.49 20.24,33.59 | v20.12,33.72 20.24,33.59 | 18.43,34.08 v18.21,34.08 18.53,33.9 18.57,33.86 18.57,33.29 18.67,33.11
  Bottom 0.203: v24.61,34.49 21.56,34.49 20.83,35.22 19.47,35.22 18.78,34.53 18.73,34.53 18.39,34.18 v18.21,34.08
  Bottom 0.406: v11.48,16.06 11.48,16.24 12.58,17.34 15.12,17.34 15.24,17.21 15.24,17.13 15.75,16.63 17.09,16.63 17.15,16.56 18.61,16.56 18.63,16.55 18.82,16.65 18.94,16.77 20.52,16.77 20.79,17.03 | v13.04,34.59 17.15,34.59 17.33,34.49 17.74,34.08 v18.21,34.08 | v20.12,33.72 23.47,30.36 23.47,18.62 23.27,18.54 22.29,18.54 20.79,17.03 | 20.79,17.03 21.74,16.08 21.74,13.68 NRF24L01.2
VRAW  (via drill 0.41)
  Top 0.406: v16.7,43.57 17.39,43.57 17.82,43.14 18.73,43.14 J2.2
  Bottom 0.406: v16.7,43.57 15.81,44.46 3.25,44.46 0.59,41.8 0.59,25.93 1.32,25.2 X2.1 | v16.7,43.57
VREG  (via drill 0.41)
  Top 0.406: IC1.5 24.15,37.17 23.96,36.99 23.96,36.95 | 23.96,36.95 23.96,36.11 C13.1 | v6.48,34.08 6.6,33.96 J1.3 | v23.75,36.95 23.96,36.95
  Bottom 0.406: v6.48,34.08 11.42,34.08 14.29,36.95 v23.75,36.95

### Text on the board
bPlace: MySensors / 1.3